# EAGLE design max631 (EAGLE 7.5.0)
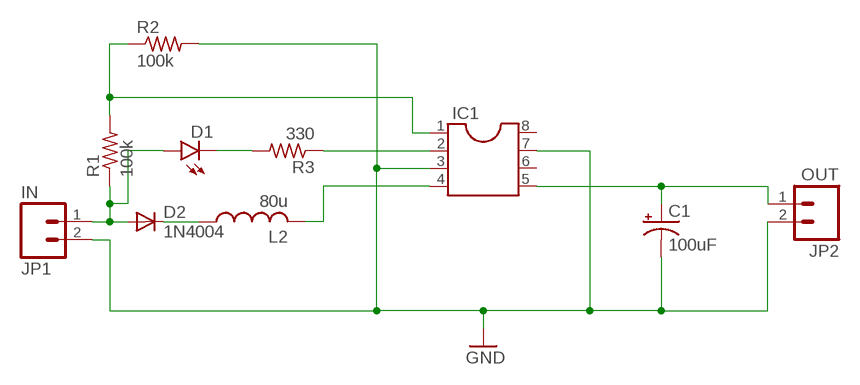
[diagram p0: schematic, sheet 1]

## Parts
C1  100uF  CPOL-USE2.5-5  [E2,5-5]
D1  LED3MM  [LED3MM]
D2  1N4004  [DO41-10]
IC1  DIL8  [DIL08]
JP1  IN  M02LOCK_LONGPADS  [1X02_LOCK_LONGPADS]
JP2  OUT  M02LOCK_LONGPADS  [1X02_LOCK_LONGPADS]
L2  80u  L-USIR-2  [IR-2]
R1  100k  R-US_0207/10  [0207/10]
R2  100k  R-US_0207/10  [0207/10]
R3  330  R-US_0207/10  [0207/10]

## Nets
GND: C1.- IC1.3 IC1.7 JP1.2 JP2.2 R2.2
N$1: D1.A D2.A JP1.1 R1.1
N$2: D2.C L2.1
N$3: IC1.1 R1.2 R2.1
N$4: C1.+ IC1.5 JP2.1
N$5: D1.K(C) R3.2
N$6: IC1.4 L2.2
N$7: IC1.2 R3.1
Unconnected: IC1.6 IC1.8

## Library data of the parts
C1 = rcl:CPOL-US: POLARIZED CAPACITOR, American symbol
D1 = SparkFun-LED:LED: LEDs Standard schematic elements and footprints for 5mm, 3mm, 1206, and 0603 sized LEDs. 5mm - Spark Fun Electronics SKU : COM-00529 (and others)
D2 = diode:1N4004: DIODE general purpose rectifier, 1 A
IC1 = ic-package:DIL8: Dual In Line / Socket
JP1 JP2 = SparkFun-Connectors:M02: Standard 2-pin 0.1" header. Use with - straight break away headers ( PRT-00116) - right angle break away headers (PRT-00553) - swiss pins (PRT-00743) - machine pins (PRT-00117) - female headers (PRT-00115) Molex polarized connector foot print use with: PRT-08233 with associated crimp pins and housings. 2.54_SCREWTERM for use with PRT-10571. 3.5mm Screw Terminal footprints for PRT-08084 5mm Screw Terminal footprints for use with PRT-08432
L2 = rcl:L-US: INDUCTOR, American symbol
R1-R3 = rcl:R-US_: RESISTOR, American symbol

## Board
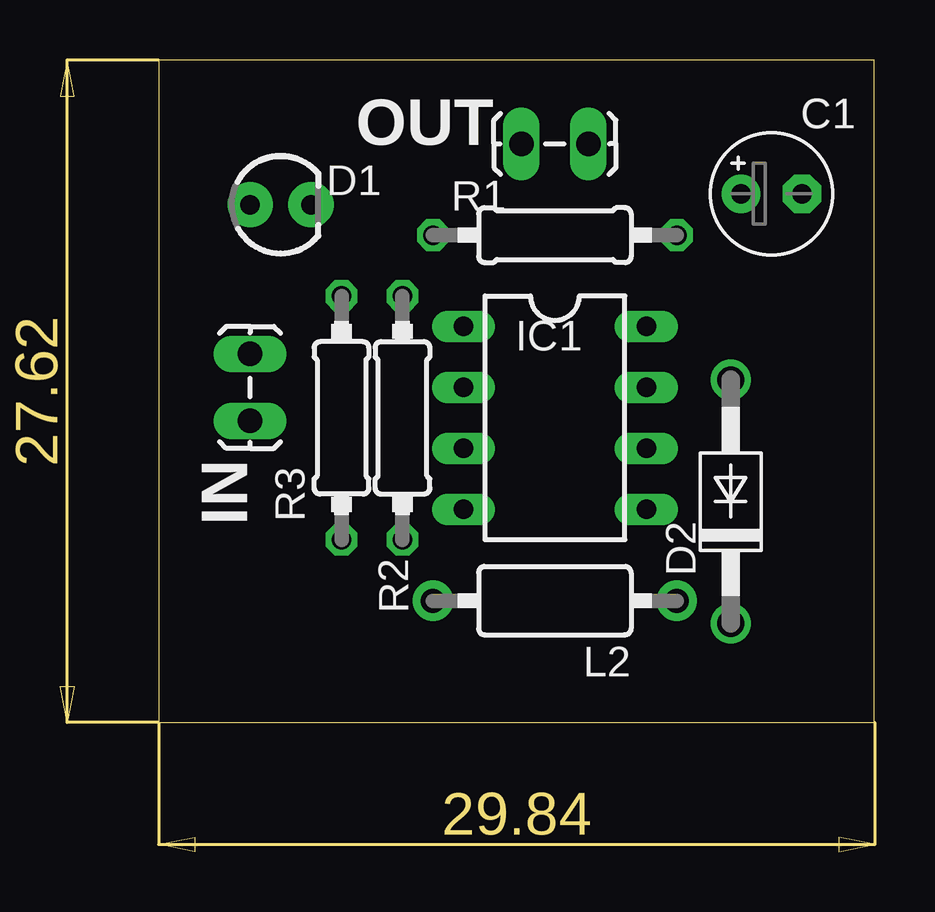
[diagram p1: board, top side]
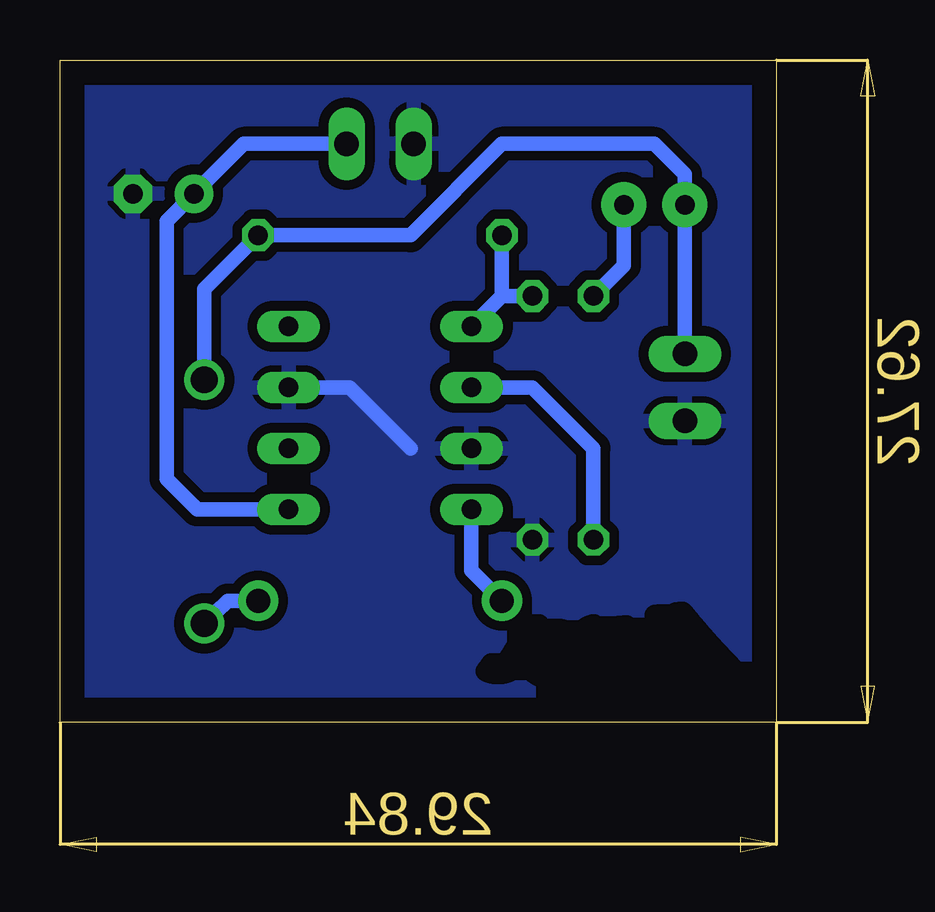
[diagram p2: board, bottom side, seen from below]

Size 29.82 x 27.61 mm. Coordinates in mm from the lower left corner, seen from the top.
Outline: 0,0 29.82,0 29.82,27.61 0,27.61 0,0
Copper layers (1*16): Top 0.035mm / dielectric 1.5mm / Bottom 0.035mm
Design rules "default": minimum track width 10mil, minimum drill 24mil, track to track 8mil, track to pad 8mil, pad to pad 8mil, via to via 8mil, smd to smd 8mil, copper to edge 40mil, drill to drill 8mil, minimum pad ring 10mil, minimum via ring 8mil, stop-mask expansion 4mil, vias tented up to drill 0mil, thermal gap 10mil
tRestrict: area 11.3,1 to 11.4,1; area 11.3,1 to 11.4,1; area 11.3,1 to 11.4,1.1; area 11.3,1.1 to 11.4,1.1; area 11.3,1.1 to 11.4,1.1; area 11.3,1.1 to 11.4,1.1; area 11.3,1.1 to 11.4,1.1; area 11.3,1.1 to 11.4,1.1; area 11.3,1.1 to 11.4,1.1; area 11.3,1.1 to 11.4,1.1; area 11.3,1.1 to 11.4,1.1; area 11.3,1.1 to 11.5,1.1; 3592 more areas
bRestrict: area 1.6,1.3 to 1.6,1.3; area 1.6,1.3 to 1.6,1.3; area 1.6,1.3 to 1.6,1.3; area 1.6,1.3 to 1.6,1.3; area 1.6,1.3 to 1.6,1.3; area 1.6,1.3 to 1.6,1.4; area 1.5,1.4 to 1.6,1.4; area 1.5,1.4 to 1.6,1.4; area 1.5,1.4 to 1.6,1.4; area 1.5,1.4 to 1.6,1.4; area 1.5,1.4 to 1.7,1.4; area 1.5,1.4 to 1.7,1.4; 3592 more areas

### Footprints (pad centres in the part's own frame; a part is rotated, then mirrored left to right if it is on the bottom)
E2,5-5 = drill 0.813 pad 1.6: + -1.27,0 | drill 0.813 pad 1.6 octagon: - 1.27,0
LED3MM = drill 0.813 pad 1.88: A -1.27,0; K 1.27,0
DO41-10 = drill 1.118: A 5.08,0; C -5.08,0
DIL08 = drill 0.813 long: 1 -3.81,-3.81; 2 -1.27,-3.81; 3 1.27,-3.81; 4 3.81,-3.81; 5 3.81,3.81; 6 1.27,3.81; 7 -1.27,3.81; 8 -3.81,3.81
1X02_LOCK_LONGPADS = drill 1.016 long: 1 -0.127,0; 2 2.667,0
IR-2 = drill 1 pad 1.676: 1 -5.08,0; 2 5.08,0
0207/10 = drill 0.813 octagon: 1 -5.08,0; 2 5.08,0

### Placement (x,y rotation side)
C1  25.54,22.04 0 top
D1  5.08,21.59 0 top
D2  23.84,9.21 90 top
IC1  16.51,12.7 270 top
JP1  3.81,15.24 270 top
JP2  17.78,24.13 180 top
L2  16.51,5.08 180 top
R1  16.51,20.32 180 top
R2  10.16,12.7 270 top
R3  7.62,12.7 90 top

### Tracks (layer width: path | path; a pad name or v marks a point on that pad's centre or on a via)
GND
  Bottom 0.61: 15.24,11.43 17.78,13.97 IC1.7
  pour Bottom (isolate 0.406): 0,0 38.1,0 38.1,35.56 0,35.56
N$1
  Bottom 0.61: JP1.1 D1.A 3.81,22.86 5.08,24.13 11.43,24.13 15.24,20.32 R1.1 23.84,18.07 D2.A
N$2
  Bottom 0.61: L2.1 22.86,5.08 D2.C
N$3
  Bottom 0.61: R2.1 11.43,17.78 | 11.43,17.78 IC1.1 | R1.2 11.43,17.78
N$4
  Bottom 0.61: JP2.1 22.18,24.13 C1.+ 25.4,20.91 25.4,10.16 24.13,8.89 IC1.5
N$5
  Bottom 0.61: D1.K 6.35,19.05 R3.2
N$6
  Bottom 0.61: IC1.4 12.7,6.35 L2.2
N$7
  Bottom 0.61: R3.1 7.62,11.43 10.16,13.97 IC1.2

### Text on the board
tRestrict: C:/Users/Jose/Pictures/JoseM.bmp
bRestrict: C:/Users/Jose/Pictures/JoseM_mirror.bmp
200bmp: C:/Users/Jose/Pictures/JoseM.bmp